# Altium project MyMU2.PrjPcb
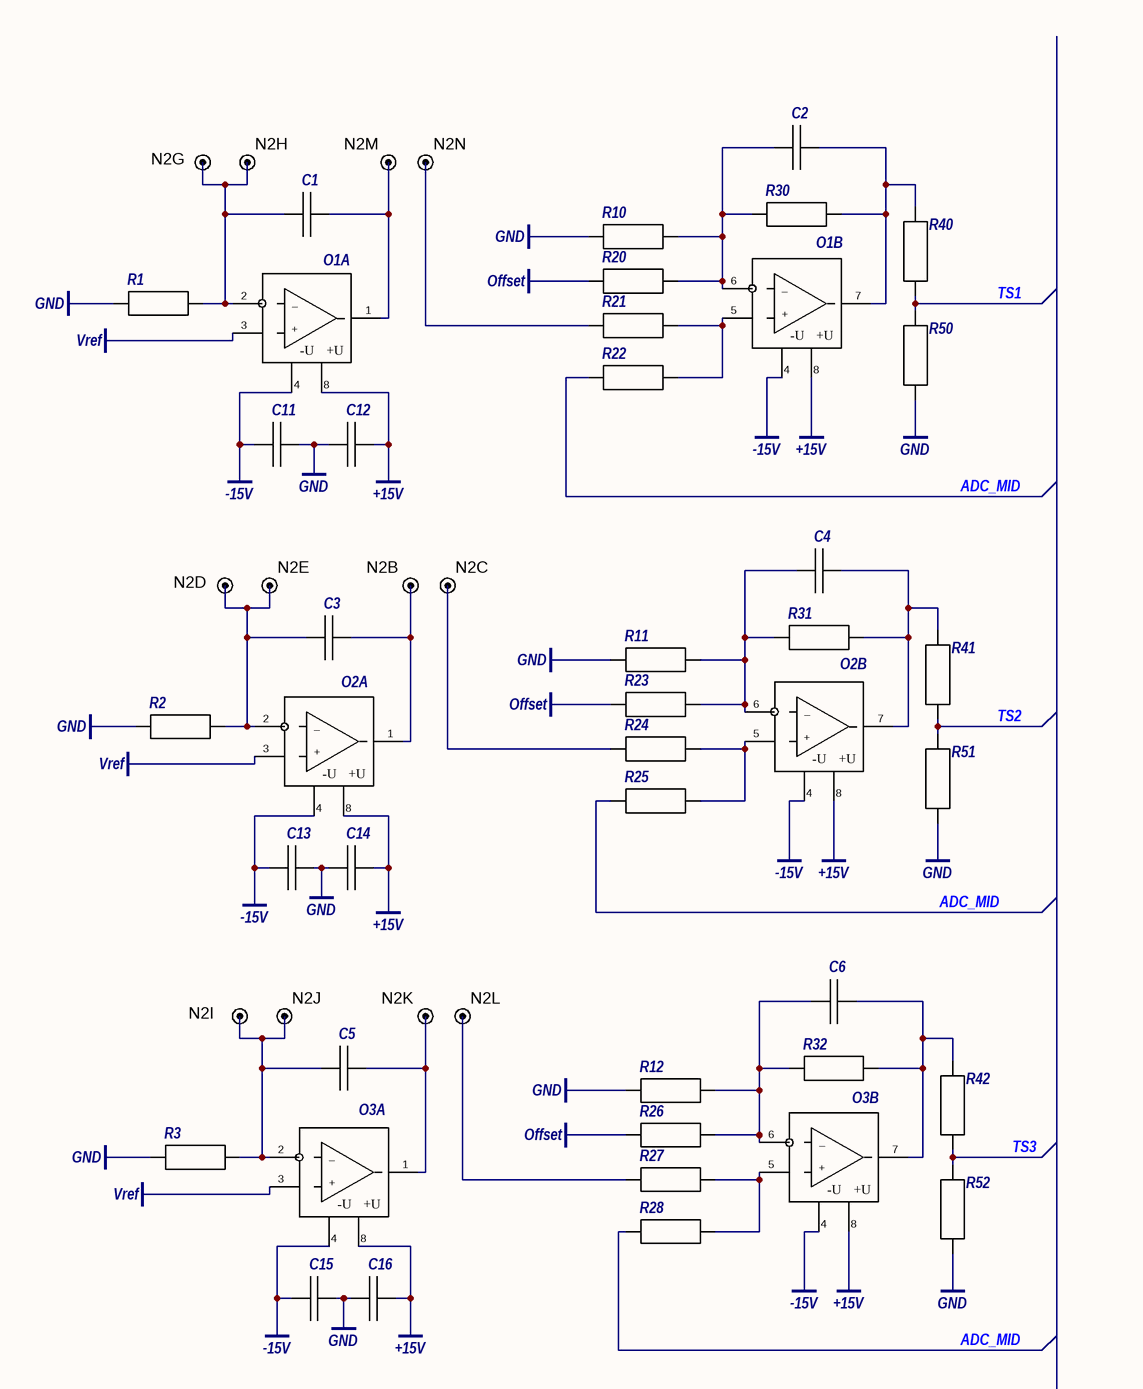
[diagram p0: MyADC.SchDoc, top]
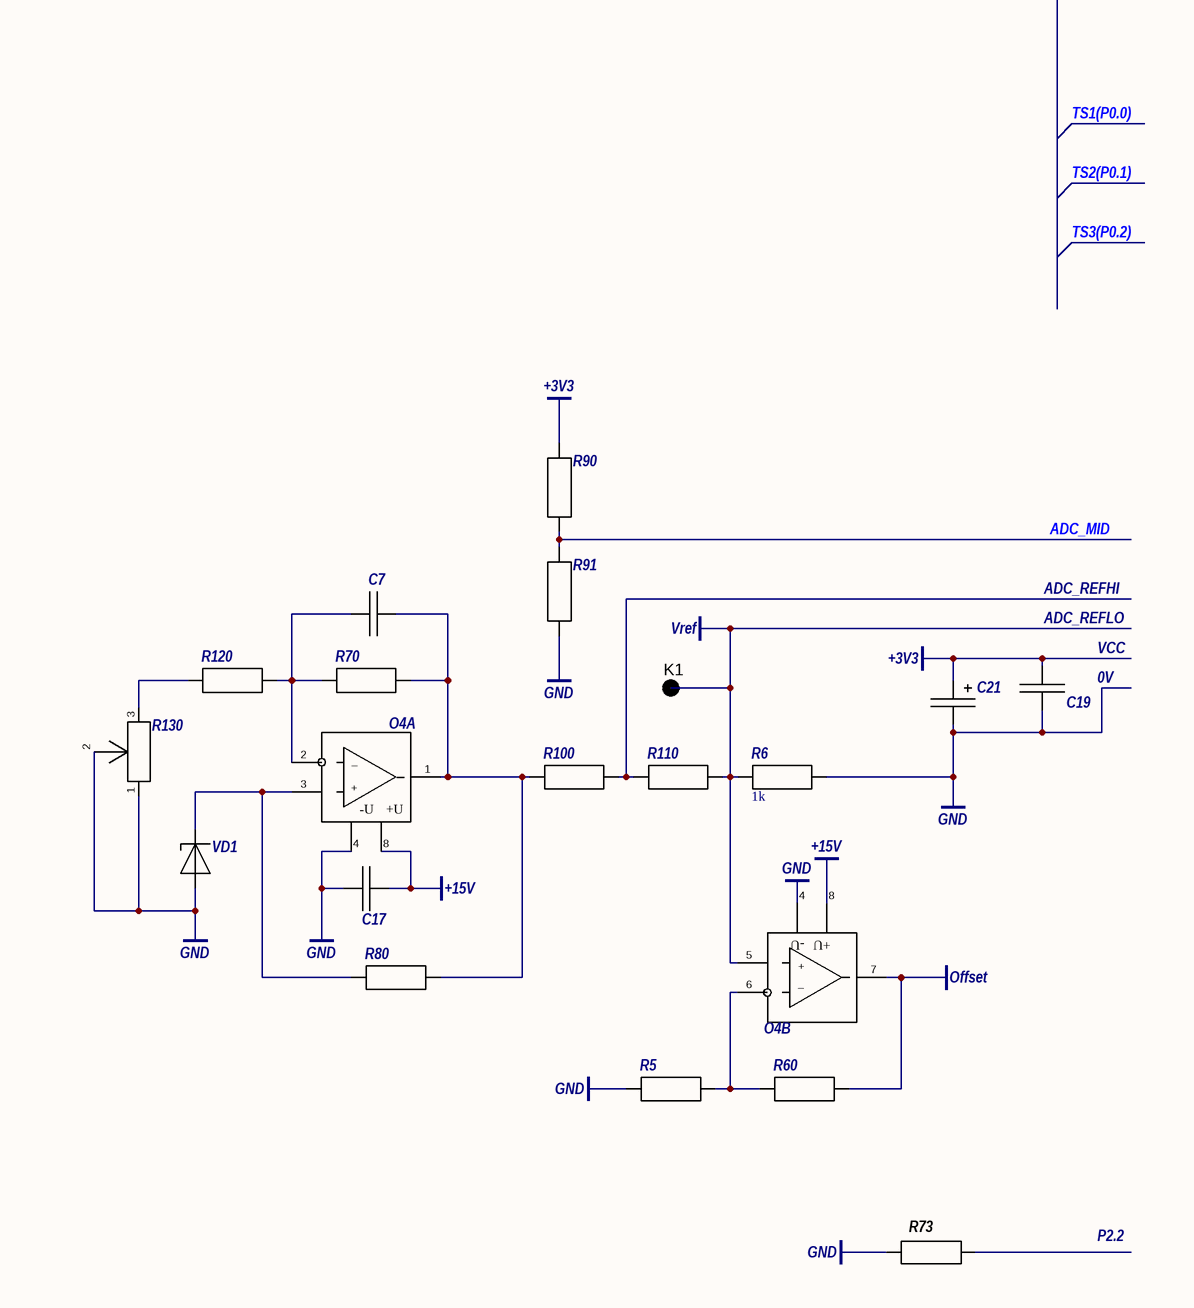
[diagram p1: MyADC.SchDoc, bottom]
1 sheet, 59 parts. Net scope: global (net labels, ports and power ports of the same name join across sheets).
Board files: MyMU2.PcbDoc, Shablon.PcbDoc

## Sheet MyADC.SchDoc
size 420 x 594 mm; Author: Demenev; Address1: Деменев Д.А.; Address2: Петров С.А.; SheetNumber: 1; INDEX: Усилительное Устройство

### Parts
K1  K  [K]  (value not drawn)
N2  (no value)  [KOL26]  (parts B,C,D,E,G,H,I,J,K,L,M,N of 26)
O1  OP284FS  [MS-012-AA]  (value not drawn)  (parts A,B of 2)
O2  OP284FS  [MS-012-AA]  (value not drawn)  (parts A,B of 2)
O3  OP284FS  [MS-012-AA]  (value not drawn)  (parts A,B of 2)
O4  OP284FS  [MS-012-AA]  (value not drawn)  (parts A,B of 2)
R1  MF-25 (c2-23) 0.25/0.125Вт, 1кОм, 1%  (value not drawn)
R2  MF-25 (c2-23) 0.25/0.125Вт, 1кОм, 1%  (value not drawn)
R3  MF-25 (c2-23) 0.25/0.125Вт, 1кОм, 1%  (value not drawn)
R5  MF-25 (c2-23) 0.25/0.125Вт, 1кОм, 1%  (value not drawn)
R6  value 1k  (hidden comment: MF-25 (c2-23) 0.25/0.125Вт, 1кОм, 1%)
R10  MF-25 (c2-23) 0.25/0.125Вт, 24кОм, 1%  (value not drawn)
R11  MF-25 (c2-23) 0.25/0.125Вт, 24кОм, 1%  (value not drawn)
R12  MF-25 (c2-23) 0.25/0.125Вт, 24кОм, 1%  (value not drawn)
R20  MF-25 (c2-23) 0.25/0.125Вт, 20кОм, 1%  (value not drawn)
R21  MF-25 (c2-23) 0.25/0.125Вт, 20кОм, 1%  (value not drawn)
R22  MF-25 (c2-23) 0.25/0.125Вт, 20кОм, 1%  (value not drawn)
R23  MF-25 (c2-23) 0.25/0.125Вт, 20кОм, 1%  (value not drawn)
R24  MF-25 (c2-23) 0.25/0.125Вт, 20кОм, 1%  (value not drawn)
R25  MF-25 (c2-23) 0.25/0.125Вт, 20кОм, 1%  (value not drawn)
R26  MF-25 (c2-23) 0.25/0.125Вт, 20кОм, 1%  (value not drawn)
R27  MF-25 (c2-23) 0.25/0.125Вт, 20кОм, 1%  (value not drawn)
R28  MF-25 (c2-23) 0.25/0.125Вт, 20кОм, 1%  (value not drawn)
R30  MF-25 (c2-23) 0.25/0.125Вт, 100кОм, 1%  (value not drawn)
R31  MF-25 (c2-23) 0.25/0.125Вт, 100кОм, 1%  (value not drawn)
R32  MF-25 (c2-23) 0.25/0.125Вт, 100кОм, 1%  (value not drawn)
R40  MF-25 (c2-23) 0.25/0.125Вт, 2кОм, 1%  (value not drawn)
R41  MF-25 (c2-23) 0.25/0.125Вт, 2кОм, 1%  (value not drawn)
R42  MF-25 (c2-23) 0.25/0.125Вт, 2кОм, 1%  (value not drawn)
R50  MF-25 (c2-23) 0.25/0.125Вт, 510Ом, 1%  (value not drawn)
R51  MF-25 (c2-23) 0.25/0.125Вт, 510Ом, 1%  (value not drawn)
R52  MF-25 (c2-23) 0.25/0.125Вт, 510Ом, 1%  (value not drawn)
R60  MF-25 (c2-23) 0.25/0.125Вт,2.7кОм, 1%  (value not drawn)
R70  MF-25 (c2-23) 0.25/0.125Вт, 3.6кОм, 1%  (value not drawn)
R73  (no value)  [R1_112_W125]
R80  MF-25 (c2-23) 0.25/0.125Вт,470Ом, 1%  (value not drawn)
R90  MF-25 (c2-23) 0.25/0.125Вт, 62кОм, 1%  (value not drawn)
R91  MF-25 (c2-23) 0.25/0.125Вт, 62кОм, 1%  (value not drawn)
R100  MF-25 (c2-23) 0.25/0.125Вт, 7.5кОм, 1%  (value not drawn)
R110  MF-25 (c2-23) 0.25/0.125Вт, 1.3кОм, 1%  (value not drawn)
R120  MF-25 (c2-23) 0.25/0.125Вт, 4.3кОм, 1%  (value not drawn)
R130  3266Р-1-502LF, 5kОм, 0.25 Вт,N=11, 10%  (value not drawn)
VD1  2C168A  (value not drawn)
С1  K10-17A, Н50, 0.1 mkF,50V  (value not drawn)
С2  K10-17A, Н50, 0.1 mkF,50V  (value not drawn)
С3  K10-17A, Н50, 0.1 mkF,50V  (value not drawn)
С4  K10-17A, Н50, 0.1 mkF,50V  (value not drawn)
С5  K10-17A, Н50, 0.1 mkF,50V  (value not drawn)
С6  K10-17A, Н50, 0.1 mkF,50V  (value not drawn)
С7  K10-17A, Н50, 0.1 mkF,50V  (value not drawn)
С11  K10-17A, Н90, 0.1 mkF,40V  (value not drawn)
С12  K10-17A, Н90, 0.1 mkF,40V  (value not drawn)
С13  K10-17A, Н90, 0.1 mkF,40V  (value not drawn)
С14  K10-17A, Н90, 0.1 mkF,40V  (value not drawn)
С15  K10-17A, Н90, 0.1 mkF,40V  (value not drawn)
С16  K10-17A, Н90, 0.1 mkF,40V  (value not drawn)
С17  K10-17A, Н90, 0.1 mkF,40V  (value not drawn)
С19  K10-17A, Н90, 0.1 mkF,40V  (value not drawn)
С21  ECAR 10mkF, 16V, 20%  (value not drawn)

### Nets
+3V3: R90.2 С19.2 С21.Plus
+15V: O1.8(+U) O2.8(+U) O3.8(+U) O4.8(+U) С12.2 С14.2 С16.2 С17.2
-15V: O1.4(-U) O2.4(-U) O3.4(-U) С11.1 С13.1 С15.1
GND: O4.4(-U) R1.1 R2.1 R3.1 R5.1 R6.2 R10.1 R11.1 R12.1 R50.1 R51.1 R52.1 R73.1 R91.1 R130.1 R130.2 VD1.Plus С11.2 С12.1 С13.2 С14.1 С15.2 С16.1 С17.1 С19.1 С21.Minus
Offset: O4.7(OUT) R20.1 R23.1 R26.1 R60.2
Vref: K1.1 O1.3(IN+) O2.3(IN+) O3.3(IN+) O4.5(IN+) R6.1 R110.2
ADC_MID: R22.1 R25.1 R28.1 R90.1 R91.2
TS1: R40.1 R50.2
TS2: R41.1 R51.2
TS3: R42.1 R52.2
NetN2_2: N2.2 O2.1(OUT) С3.2
NetN2_3: N2.3 R24.1
NetN2_4: N2.4 N2.5 O2.2(IN-) R2.2 С3.1
NetN2_7: N2.7 N2.8 O1.2(IN-) R1.2 С1.1
NetN2_9: N2.9 N2.10 O3.2(IN-) R3.2 С5.1
NetN2_11: N2.11 O3.1(OUT) С5.2
NetN2_12: N2.12 R27.1
NetN2_13: N2.13 O1.1(OUT) С1.2
NetN2_14: N2.14 R21.1
NetO1_5: O1.5(IN+) R21.2 R22.2
NetO1_6: O1.6(IN-) R10.2 R20.2 R30.1 С2.1
NetO1_7: O1.7(OUT) R30.2 R40.2 С2.2
NetO2_5: O2.5(IN+) R24.2 R25.2
NetO2_6: O2.6(IN-) R11.2 R23.2 R31.1 С4.1
NetO2_7: O2.7(OUT) R31.2 R41.2 С4.2
NetO3_5: O3.5(IN+) R27.2 R28.2
NetO3_6: O3.6(IN-) R12.2 R26.2 R32.1 С6.1
NetO3_7: O3.7(OUT) R32.2 R42.2 С6.2
NetO4_1: O4.1(OUT) R70.2 R80.2 R100.1 С7.2
NetO4_2: O4.2(IN-) R70.1 R120.2 С7.1
NetO4_3: O4.3(IN+) R80.1 VD1.Minus
NetO4_6: O4.6(IN-) R5.2 R60.1
NetR100_2: R100.2 R110.1
NetR120_1: R120.1 R130.3

Not connected (* = marked no-connect by the designer): R73 2

### Notes on the sheet
- ADC_REFHI
- (near С19) ADC_REFLO
- VCC
- (near С19) 0V
- P2.2
- Подпись и дата
- Инв.№ дубл.
- Взам. инв. №
- Инв. № подл.
- Лист
- Изм.
- №  докум.
- Подпись
- Дата
- (in symbol OP284, part A) –; +
- (in symbol OP284, part B) –; +

### Library data of the parts
N2 = bSNP333-26: board analog SNP333-26; ValueType: Соединитель; ValueName: БСНП333-26; Part Number: bSNP333-26; ComponentLink1Description: Datasheet
O1-O4 = OP284: operational amplifier; Input Voltage: ±18 V; Junction Temperature Range: −65°C to +150°C; ValueType: Микросхема; Package: 8-Lead SOIC (S-Suffix); PartNumber: OP284FS; ValueName: OP284FS; ComponentLink1URL: C:\Users\Дмитрий\Desktop\Дима\4 курс\2 семестр\Курсовая работа 4курс 2 сем\MyMU2\DataSheet\OP184_284_484.pdf; ComponentLink1Description: Datasheet
R1-R3 R5 = MF-25 (c2-23)1kOm: Resistor; ValueType: Резистор; Value: 1k; PartNumber: MF-25 (c2-23) 0.25/0.125Вт, 1кОм, 1%; ComponentLink1Description: Datasheet; ComponentLink1URL: C:\Users\Дмитрий\Desktop\Дима\4 курс\2 семестр\Курсовая работа 4курс 2 сем\MyMU2\DataSheet\C2-23; Package: C2-23
R6 = MF-25 (c2-23)1kOm: Resistor; ValueType: Резистор; PartNumber: MF-25 (c2-23) 0.25/0.125Вт, 1кОм, 1%; ComponentLink1Description: Datasheet; ComponentLink1URL: C:\Users\Дмитрий\Desktop\Дима\4 курс\2 семестр\Курсовая работа 4курс 2 сем\MyMU2\DataSheet\C2-23; Package: C2-23
R10-R12 = MF-25 (c2-23)24kOm: Resistor; ValueType: Резистор; Value: 24k; PartNumber: MF-25 (c2-23) 0.25/0.125Вт, 24кОм, 1%; ComponentLink1Description: Datasheet; ComponentLink1URL: C:\Users\Дмитрий\Desktop\Дима\4 курс\2 семестр\Курсовая работа 4курс 2 сем\MyMU2\DataSheet\C2-23; Package: C2-23
R20-R28 = MF-25 (c2-23)20kOm: Resistor; ValueType: Резистор; Value: 20k; PartNumber: MF-25 (c2-23) 0.25/0.125Вт, 20кОм, 1%; ComponentLink1Description: Datasheet; ComponentLink1URL: C:\Users\Дмитрий\Desktop\Дима\4 курс\2 семестр\Курсовая работа 4курс 2 сем\MyMU2\DataSheet\C2-23; Package: C2-23
R30-R32 = MF-25 (c2-23)100kOm: Resistor; ValueType: Резистор; Value: 100k; PartNumber: MF-25 (c2-23) 0.25/0.125Вт, 100кОм, 1%; ComponentLink1Description: Datasheet; ComponentLink1URL: C:\Users\Дмитрий\Desktop\Дима\4 курс\2 семестр\Курсовая работа 4курс 2 сем\MyMU2\DataSheet\C2-23; Package: C2-23
R40-R42 = MF-25 (c2-23)2kOm: Resistor; ValueType: Резистор; Value: 2k; PartNumber: MF-25 (c2-23) 0.25/0.125Вт, 2кОм, 1%; ComponentLink1Description: Datasheet; ComponentLink1URL: C:\Users\Дмитрий\Desktop\Дима\4 курс\2 семестр\Курсовая работа 4курс 2 сем\MyMU2\DataSheet\C2-23; Package: C2-23
R50-R52 = MF-25 (c2-23)510Om: Resistor; ValueType: Резистор; Value: 510; PartNumber: MF-25 (c2-23) 0.25/0.125Вт, 510Ом, 1%; ComponentLink1Description: Datasheet; ComponentLink1URL: C:\Users\Дмитрий\Desktop\Дима\4 курс\2 семестр\Курсовая работа 4курс 2 сем\MyMU2\DataSheet\C2-23; Package: C2-23
R60 = MF-25 (c2-23)2.7kOm: Resistor; ValueType: Резистор; Value: 2.7k; PartNumber: MF-25 (c2-23) 0.25/0.125Вт,2.7кОм, 1%; ComponentLink1Description: Datasheet; ComponentLink1URL: C:\Users\Дмитрий\Desktop\Дима\4 курс\2 семестр\Курсовая работа 4курс 2 сем\MyMU2\DataSheet\C2-23; Package: C2-23
R70 = MF-25 (c2-23)3.6kOm: Resistor; ValueType: Резистор; Value: 3.6k; PartNumber: MF-25 (c2-23) 0.25/0.125Вт, 3.6кОм, 1%; ComponentLink1Description: Datasheet; ComponentLink1URL: C:\Users\Дмитрий\Desktop\Дима\4 курс\2 семестр\Курсовая работа 4курс 2 сем\MyMU2\DataSheet\C2-23; Package: C2-23
R73 = R1-112-0W125-101±5: chip; Value: 100; ValueType: Резистор; ValueName: Р1-112-0,125-100 Ом±5%-К-А; ValueTechReq: ДАРГ.434110.004ТУ; Mass: 0.006; Part Number: R1-112-0W125-101±5; ComponentLink1URL: C:\AltiumLib\pdf\ТУ_Р1-112.pdf; ComponentLink1Description: Datasheet
R80 = MF-25 (c2-23)470Om: Resistor; ValueType: Резистор; Value: 470; PartNumber: MF-25 (c2-23) 0.25/0.125Вт,470Ом, 1%; ComponentLink1Description: Datasheet; ComponentLink1URL: C:\Users\Дмитрий\Desktop\Дима\4 курс\2 семестр\Курсовая работа 4курс 2 сем\MyMU2\DataSheet\C2-23; Package: C2-23
R90 R91 = MF-25 (c2-23)62kOm: Resistor; ValueType: Резистор; Value: 62k; PartNumber: MF-25 (c2-23) 0.25/0.125Вт, 62кОм, 1%; ComponentLink1Description: Datasheet; ComponentLink1URL: C:\Users\Дмитрий\Desktop\Дима\4 курс\2 семестр\Курсовая работа 4курс 2 сем\MyMU2\DataSheet\C2-23; Package: C2-23
R100 = MF-25 (c2-23)7.5kOm: Resistor; ValueType: Резистор; Value: 7.5k; PartNumber: MF-25 (c2-23) 0.25/0.125Вт, 7.5кОм, 1%; ComponentLink1Description: Datasheet; ComponentLink1URL: C:\Users\Дмитрий\Desktop\Дима\4 курс\2 семестр\Курсовая работа 4курс 2 сем\MyMU2\DataSheet\C2-23; Package: C2-23
R110 = MF-25 (c2-23)1.3kOm: Resistor; ValueType: Резистор; Value: 1.3k; PartNumber: MF-25 (c2-23) 0.25/0.125Вт, 1.3кОм, 1%; ComponentLink1Description: Datasheet; ComponentLink1URL: C:\Users\Дмитрий\Desktop\Дима\4 курс\2 семестр\Курсовая работа 4курс 2 сем\MyMU2\DataSheet\C2-23; Package: C2-23
R120 = MF-25 (c2-23)4.3kOm: Resistor; ValueType: Резистор; Value: 4.3k; PartNumber: MF-25 (c2-23) 0.25/0.125Вт, 4.3кОм, 1%; ComponentLink1Description: Datasheet; ComponentLink1URL: C:\Users\Дмитрий\Desktop\Дима\4 курс\2 семестр\Курсовая работа 4курс 2 сем\MyMU2\DataSheet\C2-23; Package: C2-23
R130 = 3266Р-1-502LF: Reostat; ValueType: Резистор переменный; Value: 5k; PartNumber: 3266Р-1-502LF, 5kОм, 0.25 Вт,N=11, 10%; ComponentLink1Description: Datasheet; ComponentLink1URL: C:\Users\Дмитрий\Desktop\Дима\4 курс\2 семестр\Курсовая работа 4курс 2 сем\MyMU2\DataSheet\3266; Package: 3266
VD1 = 2C168A: Vmax: 7.5V; Vmin: 6.1V; Vnom: 6.8V; ValueType: Стабилитрон; Part Number: 2C168A; ValueName: 2C168A; ComponentLink1Description: Datasheet; ComponentLink1URL: C:\Users\Дмитрий\Desktop\Дима\4 курс\2 семестр\Курсовая работа 4курс 2 сем\MyMU2\DataSheet\Kd4.pdf
С1-С7 = К10-17А, Н50: ChipCapasitor; ValueName: К10-17А, Н50, 0.1 мкф,50В; ValueType: Конденсатор; Value: 0.1mkF; Part Number: K10-17A, Н50, 0.1 mkF,50V; ComponentLink1Description: Datasheet; ComponentLink1URL: C:\Users\Дмитрий\Desktop\Дима\4 курс\2 семестр\Курсовая работа 4курс 2 сем\MyMU2\DataSheet\K10-17a
С11-С17 С19 = К10-17А, Н90: ChipCapasitor; ValueName: К10-17А, Н90, 0.1 мкф,40В; ValueType: Конденсатор; Value: 0.1mkF; Part Number: K10-17A, Н90, 0.1 mkF,40V; ComponentLink1Description: Datasheet; ComponentLink1URL: C:\Users\Дмитрий\Desktop\Дима\4 курс\2 семестр\Курсовая работа 4курс 2 сем\MyMU2\DataSheet\K10-17a
С21 = ECAR 10мкф: ChipCapasitor; ValueName: ECAR 10мкф, 16 В, 20%; ValueType: Конденсатор; Part Number: ECAR 10mkF, 16V, 20%; ComponentLink1Description: Datasheet; ComponentLink1URL: C:\Users\Дмитрий\Desktop\Дима\4 курс\2 семестр\Курсовая работа 4курс 2 сем\MyMU2\DataSheet\K150-35; Value: 10mkF
K1 = K: Part Number: K; ComponentLink1Description: Datasheet